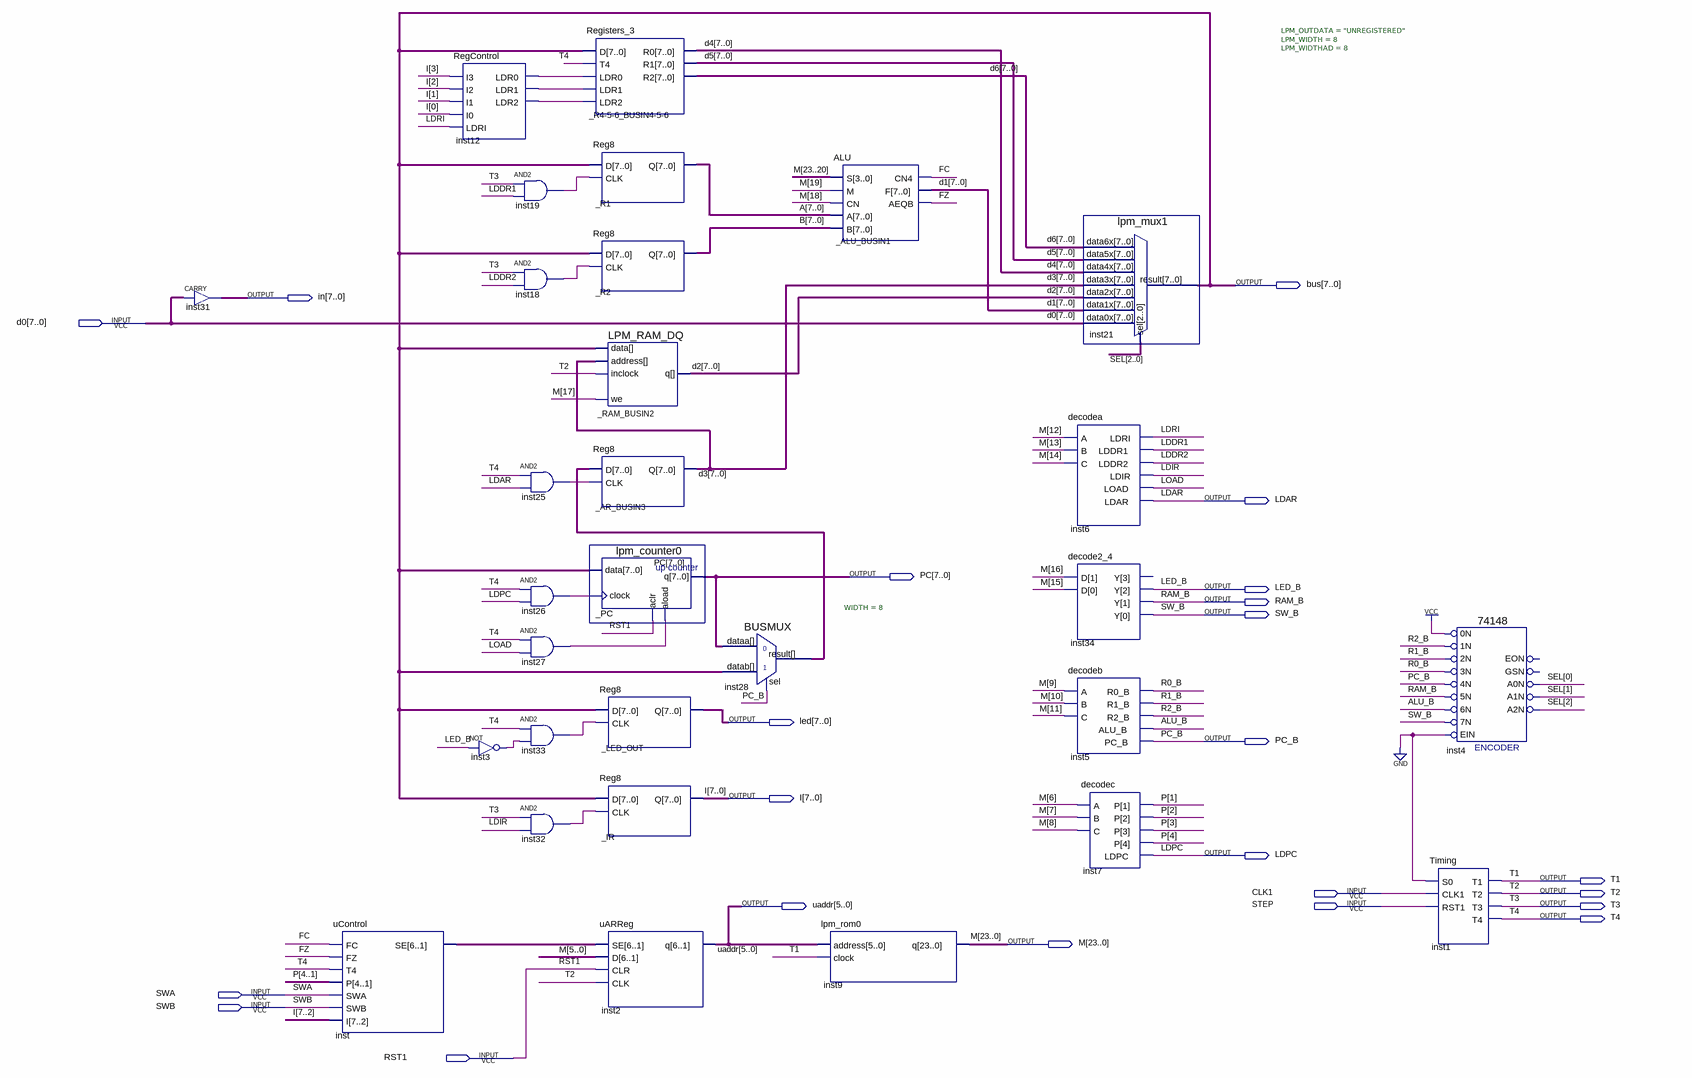
[diagram p0: schematic sheet]
// Quartus schematic mux21a2627.bdf as structural Verilog: 30 symbols, 23 pins
module mux21a2627 (
  input  [7:0] d0,
  input  CLK1,
  input  STEP,
  input  SWA,
  input  SWB,
  input  RST1,
  output [7:0] bus,
  output [7:0] in,
  output LDAR,
  output [7:0] PC,
  output LED_B,
  output RAM_B,
  output SW_B,
  output [7:0] led,
  output PC_B,
  output [7:0] I,
  output LDPC,
  output T1,
  output T2,
  output [5:0] uaddr,
  output T3,
  output T4,
  output [23:0] M
);

  wire ALU_B, FC, FZ, inst3_out, inst12_ldr0, inst12_ldr1, inst12_ldr2, inst18_out, inst19_out, inst25_out,
       inst26_out, inst27_out, inst32_out, inst33_out, LDDR1, LDDR2, LDIR, LDRI, LOAD, R0_B, R1_B, R2_B;
  wire [2:0] SEL;
  wire [4:1] P;
  wire [5:0] inst_se;
  wire [7:0] A, B, d1, d2, d3, d4, d5, d6, inst28_result;
  wire [3:0] inst34_y_open;  // unused outputs

  CARRY inst31[7:0] (.IN(d0), .OUT(in));
  uControl inst (.FC(FC), .FZ(FZ), .T4(T4), .P(P), .SWA(SWA), .SWB(SWB), .I(I[7:2]), .SE(inst_se));
  RegControl inst12 (
    .I3(I[3]), .I2(I[2]), .I1(I[1]), .I0(I[0]), .LDRI(LDRI), .LDR0(inst12_ldr0), .LDR1(inst12_ldr1),
    .LDR2(inst12_ldr2));
  not inst3 (inst3_out, LED_B);
  and inst19 (inst19_out, T3, LDDR1);
  and inst18 (inst18_out, T3, LDDR2);
  and inst25 (inst25_out, T4, LDAR);
  and inst26 (inst26_out, T4, LDPC);
  and inst27 (inst27_out, T4, LOAD);
  and inst33 (inst33_out, T4, inst3_out);
  and inst32 (inst32_out, T3, LDIR);
  Registers_3 \_R4-5-6_BUSIN4-5-6  (
    .D(bus), .T4(T4), .LDR0(inst12_ldr0), .LDR1(inst12_ldr1), .LDR2(inst12_ldr2), .R0(d4), .R1(d5), .R2(d6));
  Reg8 _R1 (.D(bus), .CLK(inst19_out), .Q(A));
  Reg8 _R2 (.D(bus), .CLK(inst18_out), .Q(B));
  LPM_RAM_DQ #(.LPM_OUTDATA("UNREGISTERED"), .LPM_WIDTH(8), .LPM_WIDTHAD(8)) _RAM_BUSIN2 (
    .address(d3), .data(bus), .inclock(T2), .we(M[17]), .q(d2));
  Reg8 _AR_BUSIN3 (.D(inst28_result), .CLK(inst25_out), .Q(d3));
  lpm_counter0 _PC (.data(bus), .clock(inst26_out), .aclr(RST1), .aload(inst27_out), .q(PC));
  Reg8 _LED_OUT (.D(bus), .CLK(inst33_out), .Q(led));
  Reg8 _IR (.D(bus), .CLK(inst32_out), .Q(I));
  uARReg inst2 (.SE(inst_se), .D(M[5:0]), .CLR(RST1), .CLK(T2), .q(uaddr));
  BUSMUX #(.WIDTH(8)) inst28 (.datab(bus), .sel(PC_B), .dataa(PC), .result(inst28_result));
  ALU _ALU_BUSIN1 (.S(M[23:20]), .M(M[19]), .CN(M[18]), .A(A), .B(B), .CN4(FC), .F(d1), .AEQB(FZ));
  lpm_rom0 inst9 (.address(uaddr), .clock(T1), .q(M));
  lpm_mux1 inst21 (
    .data6x(d6), .data5x(d5), .data4x(d4), .data3x(d3), .data2x(d2), .data1x(d1), .data0x(d0), .sel(SEL),
    .result(bus));
  decodea inst6 (
    .A(M[12]), .B(M[13]), .C(M[14]), .LDRI(LDRI), .LDDR1(LDDR1), .LDDR2(LDDR2), .LDIR(LDIR), .LOAD(LOAD),
    .LDAR(LDAR));
  decode2_4 inst34 (.D(M[16:15]), .Y({inst34_y_open[3], LED_B, RAM_B, SW_B}));
  decodeb inst5 (.A(M[9]), .B(M[10]), .C(M[11]), .R0_B(R0_B), .R1_B(R1_B), .R2_B(R2_B), .ALU_B(ALU_B), .PC_B(PC_B));
  decodec inst7 (.A(M[6]), .B(M[7]), .C(M[8]), .P(P), .LDPC(LDPC));
  \74148  inst4 (
    .\5N (RAM_B), .\0N (1'b1), .\1N (R2_B), .\2N (R1_B), .\3N (R0_B), .\4N (PC_B), .EIN(1'b0), .\6N (ALU_B),
    .\7N (SW_B), .A1N(SEL[1]), .A0N(SEL[0]), .A2N(SEL[2]));  // open: EON, GSN
  Timing inst1 (.S0(1'b0), .CLK1(CLK1), .RST1(STEP), .T1(T1), .T2(T2), .T3(T3), .T4(T4));
endmodule
